# Altium schematic sheet Ikea Environmental Sensors.SchDoc
size Tabloid; SheetNumber: 2; SheetTotal: 2; ENG_APP_DATE: --/--/--; DSN_APP_DATE: --/--/--; CHK_APP_DATE: --/--/--
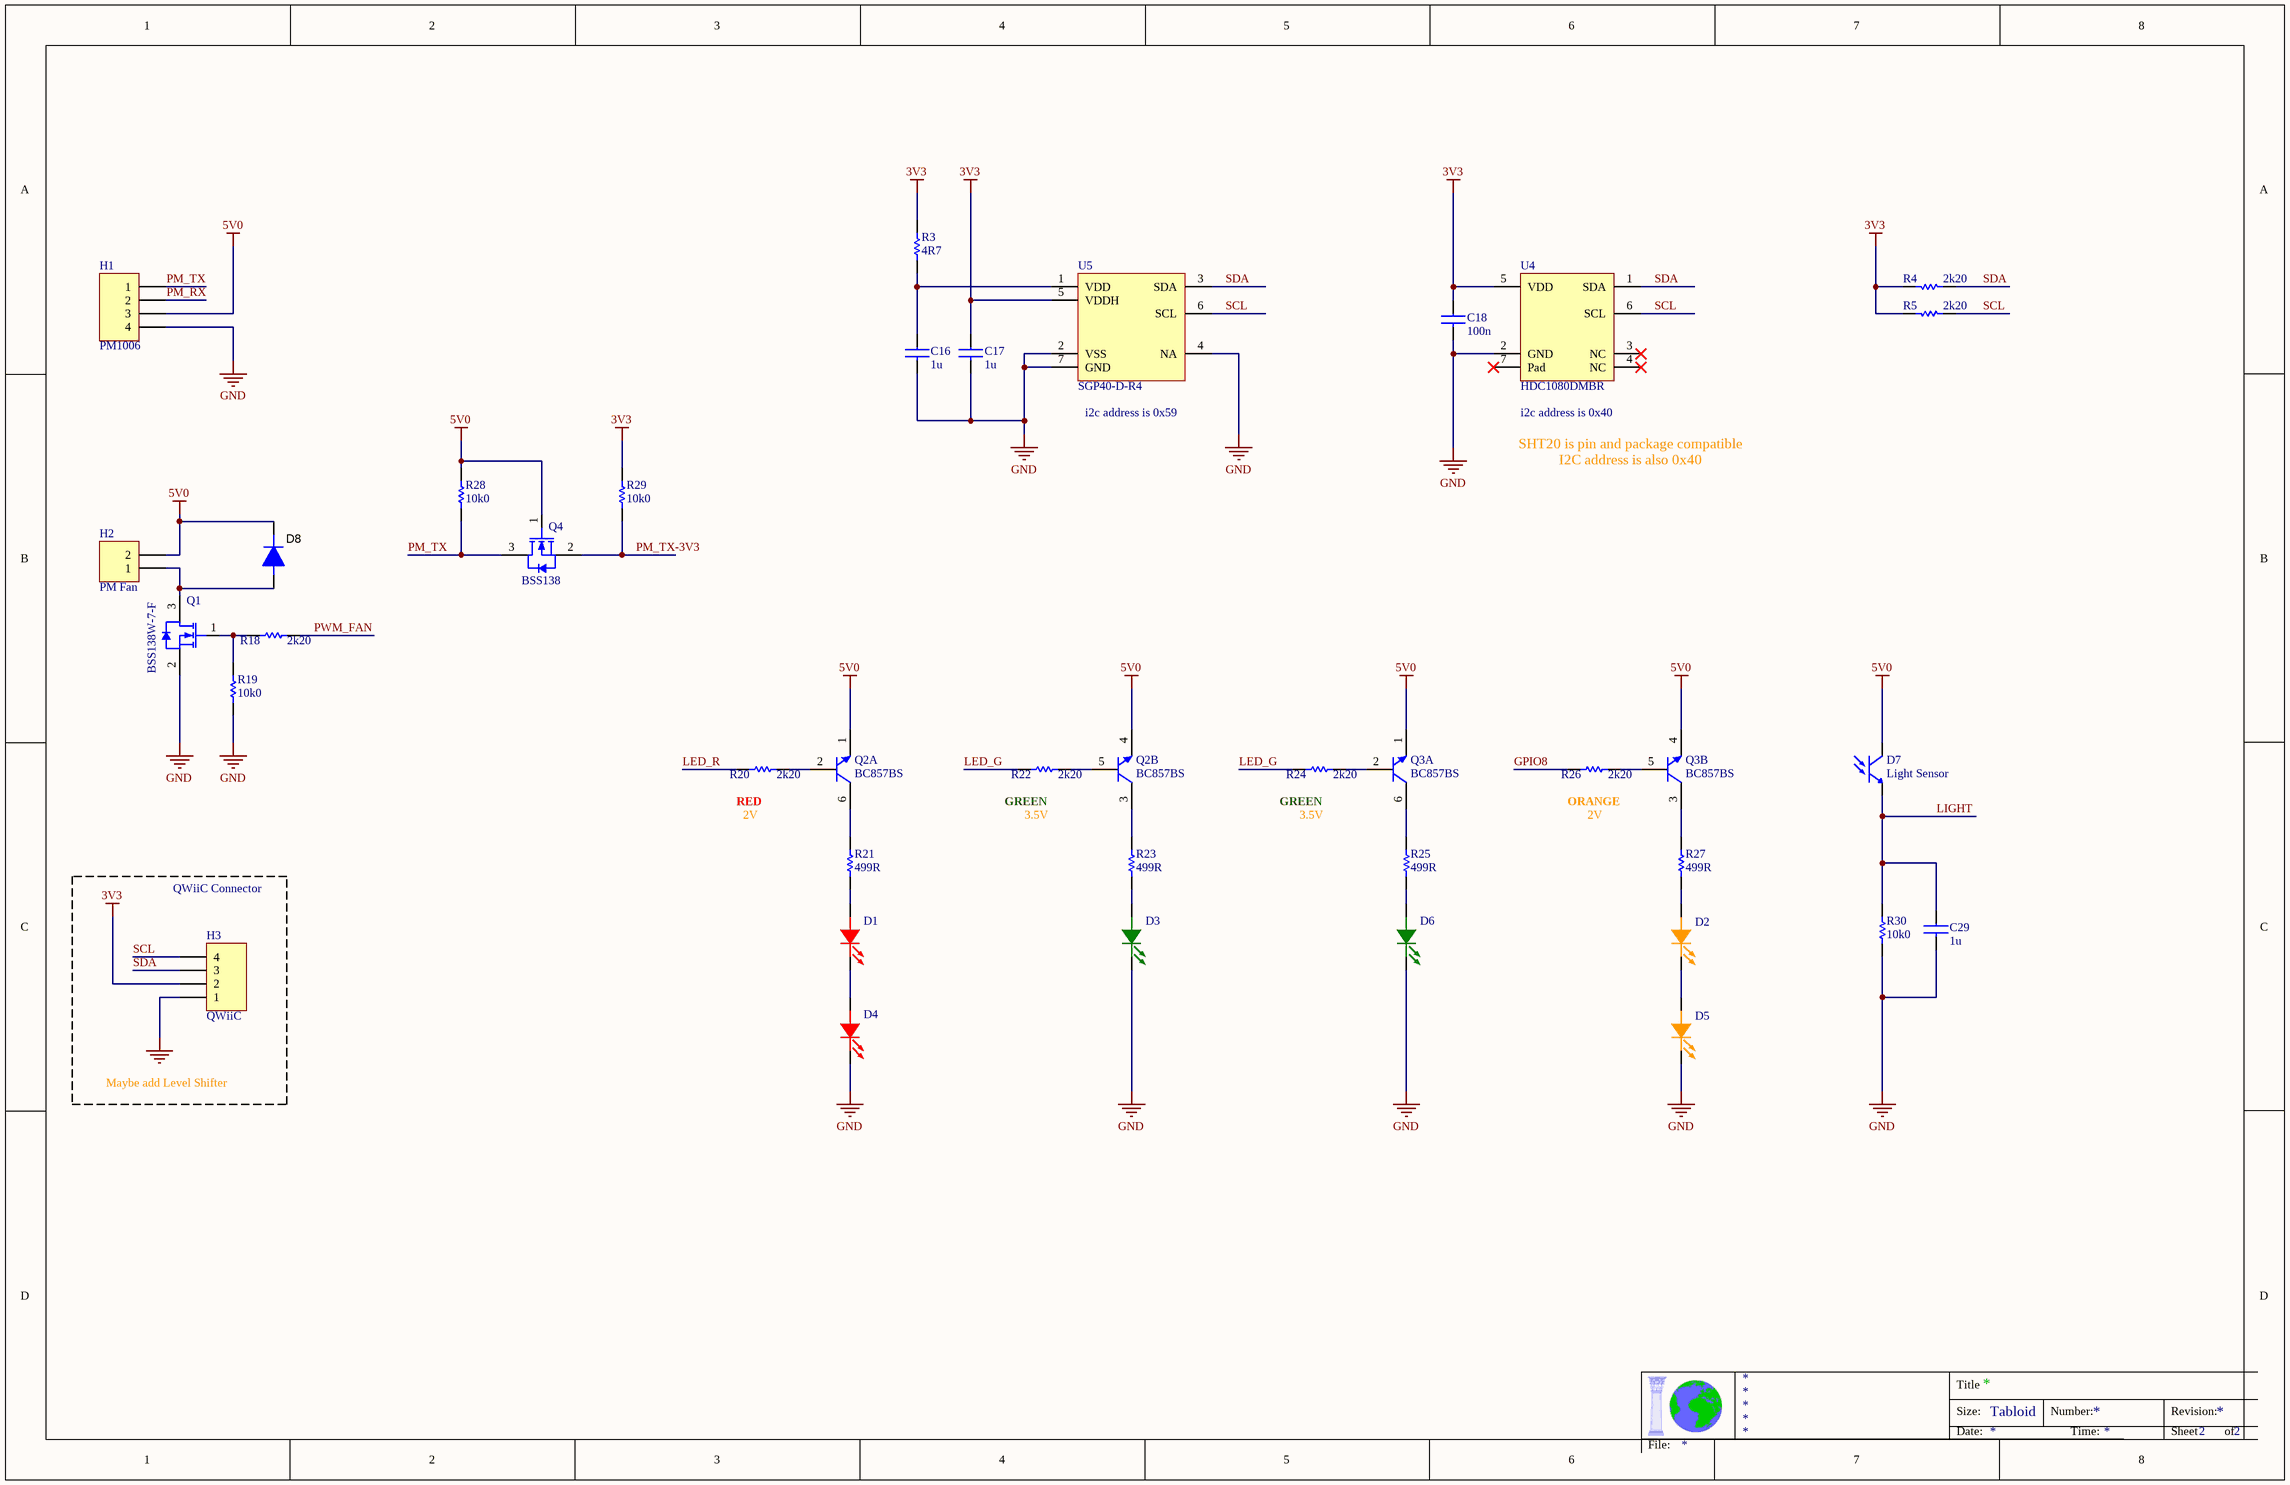
[diagram p0: Ikea Environmental Sensors.SchDoc]

## Parts
C16  1u  [C_0402_N]
C17  1u  [C_0402_N]
C18  100n  [C_0402_N]
C29  1u  [C_0402_N]
D1  0603 Red  [D_0603]  (value not drawn)
D2  0603 Orange  [D_0603]  (value not drawn)
D3  0603 Green  [D_0603]  (value not drawn)
D4  0603 Red  [D_0603]  (value not drawn)
D5  0603 Orange  [D_0603]  (value not drawn)
D6  0603 Green  [D_0603]  (value not drawn)
D7  Light Sensor  [XDCR_ALS-PT19-315C/L177/TR8]
D8  1N4148  [SOD-523]  (value not drawn)
H1  PM1006  [HDR1x4_1.5mm_RA_TH]
H2  PM Fan  [HDR1x2_1.25mm_RA_TH]
H3  QWiiC  [JST SM04B-SRSS-TB]
Q1  BSS138W-7-F  [SOT323]
Q2  BC857BS  [SOT363_N]  (parts A,B of 2)
Q3  BC857BS  [SOT363_N]  (parts A,B of 2)
Q4  BSS138  [SOT323]
R3  4R7  [R_0402-N]
R4  2k20  [R_0402-N]
R5  2k20  [R_0402-N]
R18  2k20  [R_0402-N]
R19  10k0  [R_0402-N]
R20  2k20  [R_0402-N]
R21  499R  [R_0402-N]
R22  2k20  [R_0402-N]
R23  499R  [R_0402-N]
R24  2k20  [R_0402-N]
R25  499R  [R_0402-N]
R26  2k20  [R_0402-N]
R27  499R  [R_0402-N]
R28  10k0  [R_0402-N]
R29  10k0  [R_0402-N]
R30  10k0  [R_0402-N]
U4  HDC1080DMBR  [DMB0006A]
U5  SGP40-D-R4  [SGP40_SEN-M]

## Nets
3V3: C17.1 C18.1 H3.2 R3.2 R4.1 R5.1 R29.2 U4.5(VDD) U5.5(VDDH)
5V0: D7.1(ANODE) D8.2(K) H1.3 H2.2 Q2.1(E) Q2.4(E) Q3.1(E) Q3.4(E) Q4.1(G) R28.2
GND: C16.2 C17.2 C18.2 C29.2 D3.2(CATHODE) D4.2(CATHODE) D5.2(CATHODE) D6.2(CATHODE) H1.4 H3.1 Q1.2(S) R19.1 R30.1 U4.2(GND) U5.2(VSS) U5.4(NA) U5.7(GND)
GPIO8: R26.2
LED_G: R22.2 R24.2
LED_R: R20.2
LIGHT: C29.1 D7.2(CATHODE) R30.2
PM_RX: H1.2
PM_TX: H1.1 Q4.3(D) R28.1
PM_TX-3V3: Q4.2(S) R29.1
PWM_FAN: R18.1
SCL: H3.4 R5.2 U4.6(SCL) U5.6(SCL)
SDA: H3.3 R4.2 U4.1(SDA) U5.3(SDA)
NetC16_1: C16.1 R3.1 U5.1(VDD)
NetD1_1: D1.1(ANODE) R21.1
NetD1_2: D1.2(CATHODE) D4.1(ANODE)
NetD2_1: D2.1(ANODE) R27.1
NetD2_2: D2.2(CATHODE) D5.1(ANODE)
NetD3_1: D3.1(ANODE) R23.1
NetD6_1: D6.1(ANODE) R25.1
NetD8_1: D8.1(A) H2.1 Q1.3(D)
NetQ1_1: Q1.1(G) R18.2 R19.2
NetQ2_2: Q2.2(B) R20.1
NetQ2_3: Q2.3(C) R23.2
NetQ2_5: Q2.5(B) R22.1
NetQ2_6: Q2.6(C) R21.2
NetQ3_2: Q3.2(B) R24.1
NetQ3_3: Q3.3(C) R27.2
NetQ3_5: Q3.5(B) R26.1
NetQ3_6: Q3.6(C) R25.2

Not connected (* = marked no-connect by the designer): U4 3(NC)* 4(NC)* 7(Pad)*

## Notes on the sheet
- (near U5) i2c address is 0x59
- (near U4) i2c address is 0x40
- SHT20 is pin and package compatible
  I2C address is also 0x40
- (near R20) RED
- (near R20) 2V
- (near R22) GREEN
- (near R22) 3.5V
- (near R24) GREEN
- (near R24) 3.5V
- (near R26) ORANGE
- (near R26) 2V
- QWiiC Connector
- Maybe add Level Shifter
- Title
- Size:
- Date:
- Tabloid
- Number:
- Time:
- Revision:
- Sheet
- of
- File:

## Library data of the parts
C16 C17 C29 = C_1u_10V_10_0402_NIC: Cap, Chip, 1uF, 10V, 10%, X5R, 0402; Manufacturer: NIC; Manufacturer_No: NMC0402X5R105K10TRPF; IOT: IOT-; Dist_No: NMC0402X5R105K10TRPF; Distributor: Avnet; HelpURL: http://www.niccomp.com/catalog/nmc2.pdf; Price: 0.0056; Supplier 1: Future Electronics; Supplier Part Number 1: NMC0402X5R105K10TRPF-CUTT
C18 = C_100n_16V_10_0402_NIC: Cap, Chip, 100nF, 16V, +/-10%, X7R, 0402; Manufacturer: NIC; Manufacturer_No: NMC0402X7R104K16TRPF; HelpURL: http://www.niccomp.com/catalog/nmc3.pdf; IOT: IOT-0301; Supplier 1: Future Electronics; Supplier Part Number 1: NMC0402X7R104K16TRPF-REEL
D1 D4 = D_LED-0603_LTST-C190KRKT: 0603 LED, Red, Vf=1.6-2.4V; Manufacturer: Lite-on; Distributor: Arrow; Dist_No: LTST-C190KRKT; Manufacturer_No: LTST-C190KRKT; HelpURL: http://optoelectronics.liteon.com/upload/download/DS-22-99-0151/LTST-C190KRKT.pdf; Price: 0.0376; IOT: IOT-0708; Supplier 1: Arrow Electronics; Supplier Part Number 1: LTST-C190KRKT; JLCPCB Part #: C84256; ComponentLink1Description: Datasheet; ComponentLink1URL: http://optoelectronics.liteon.com/upload/download/DS-22-99-0151/LTST-C190KRKT.pdf
D2 D5 = D_LED-0603_LTST-C190KFKT: 0603 LED, Orange, Vf=2.0-2.4V; Manufacturer: Lite-on; IOT: IOT-; Supplier 1: Arrow Electronics; Supplier Part Number 1: LTST-C190KFKT; Manufacturer_No: LTST-C190KFKT; Distributor: Arrow; HelpURL: https://optoelectronics.liteon.com/upload/download/DS-22-99-0186/LTST-C190KFKT.PDF; Price: 0.0376; Dist_No: LTST-C190KFKT; ComponentLink1Description: Datasheet; ComponentLink1URL: https://optoelectronics.liteon.com/upload/download/DS-22-99-0186/LTST-C190KFKT.PDF; JLCPCB Part #: C146215
D3 D6 = D_LED-0603_LTST-C190KGKT: 0603 LED, Green, Vf=1.9-2.4V; Manufacturer: Lite-on; Distributor: Arrow; Dist_No: LTST-C190KGKT; Manufacturer_No: LTST-C190KGKT; HelpURL: http://optoelectronics.liteon.com/upload/download/DS22-2000-074/S_110_LTST-C190KGKT.pdf; Price: 0.0376; IOT: IOT-0171; Supplier 1: Digi-Key; Supplier Part Number 1: 160-1435-1-ND; JLCPCB Part #: C72043; ComponentLink1Description: Datasheet; ComponentLink1URL: http://optoelectronics.liteon.com/upload/download/DS22-2000-074/S_110_LTST-C190KGKT.pdf
D7 = Q_Photodiode_ALS-PT19_2-SMD: Sensor, Photo, 630NM, 2-SMD; Manufacturer: Lite-on; Dist_No: ALS-PT19-315C/L177/TR8; IOT: IOT-; Distributor: Avnet; Manufacturer_No: ALS-PT19-315C/L177/TR8; HelpURL: https://everlighteurope.com/index.php?controller=attachment&id_attachment=5170; Price: 0.0376; Supplier 1: Digi-Key; Supplier Part Number 1: 1080-1244-1-ND; ComponentLink1Description: Datasheet; ComponentLink1URL: https://everlighteurope.com/index.php?controller=attachment&id_attachment=5170; JLCPCB Part #: C146233
D8 = D_1N4148WT_SOD523: Diode, Signal, 300-mA, 75-V, 350-mW, SOD523; Manufacturer: NextGeb; IOT: IOT-; Value: 1N4148WT; Manufacturer_No: 1N4148WT; Dist_No: 1N4148WT; Distributor: Arrow; HelpURL: https://media.digikey.com/pdf/Data%20Sheets/NextGen%20Components%20PDFs/SOD523148WTST4.pdf; Price: 0.0119; ComponentLink1Description: Datasheet; ComponentLink1URL: https://media.digikey.com/pdf/Data%20Sheets/NextGen%20Components%20PDFs/SOD523148WTST4.pdf; Supplier 1: Arrow Electronics; Supplier Part Number 1: 1N4148WT-7; JLCPCB Part #: C511874
H1 = Header 4_RA_1.5mm_TH: Header, 4-Pin; Manufacturer: JST; Manufacturer_No: S4B-ZR; Supplier 1: Verical; Supplier Part Number 1: S4B-ZR-SM4A-TF; JLCPCB Part #: C225169; ComponentLink1Description: Datasheet; ComponentLink1URL: https://www.jst-mfg.com/product/pdf/eng/eZH.pdf?61639681cff8b
H2 = Header 2_1.25_TH: Header, 2-Pin; ComponentLink1Description: Datasheet-Vertical; ComponentLink1URL: https://www.molex.com/pdm_docs/sd/530470210_sd.pdf; ComponentLink2Description: Datasheet-RA; ComponentLink2URL: https://www.molex.com/pdm_docs/sd/530480210_sd.pdf
H3 = Header 4_RA_1.00mm_SMT: Header, 4-Pin; Manufacturer: JST; Manufacturer_No: SM04B-SRSS-TB(LF)(SN); IOT: IOT-; Supplier 1: Digi-Key; Supplier Part Number 1: 455-1804-1-ND; JLCPCB Part #: C145956
Q1 = Q_N-CH_50V_A200_BSS138W_SOT323: MOSFET N-Channel 50V, 200mA, 200mW, SOT323; Manufacturer: Diodes Inc.; Manufacturer_No: BSS138W -7-F; Distributor: Avnet; Dist_No: BSS138W -7-F; HelpURL: http://www.diodes.com/datasheets/ds30206.pdf; Price: 0.23; IOT: IOT-0233; Supplier 1: Digi-Key; Supplier Part Number 1: BSS138W-FDITR-ND
Q2 Q3 = Q_BC857BS,115_SOT363: PNP GP Double Transistor, 45V,100mA, SOT363; Manufacturer: NXP; Manufacturer_No: BC857BS,115; Dist_No: BC857BS,115; Distributor: Arrow; HelpURL: https://assets.nexperia.com/documents/data-sheet/BC857BS.pdf; Price: 0.12000; ComponentLink1Description: Datasheet; ComponentLink1URL: https://assets.nexperia.com/documents/data-sheet/BC857BS.pdf; JLCPCB Part #: C8654; Supplier 1: Future Electronics; Supplier Part Number 1: 4266805
Q4 = Q_N-CH_50V_A200_BSS138W_SOT323: MOSFET N-Channel 50V, 200mA, 200mW, SOT323; Manufacturer_No: BSS138W -7-F; Manufacturer: Diodes Inc.; Distributor: Avnet; Dist_No: BSS138W -7-F; HelpURL: http://www.diodes.com/datasheets/ds30206.pdf; Price: 0.23; IOT: IOT-0233; Supplier 1: Digi-Key; Supplier Part Number 1: BSS138W-FDITR-ND
R3 = R_4R7_60mW_1_0402_NIC: Resistor, 4.7 Ω, 1%, 0.06W, 0402; Manufacturer_No: NRC04F4R70TRF; Manufacturer: NIC; IOT: IOT-; Distributor: NIC; Dist_No: NRC04F4R70TRF; HelpURL: http://www.niccomp.com/catalog/nrc.pdf; Value: 4R7; Supplier 1: Arrow Electronics; Supplier Part Number 1: NRC04F4R70TRF
R4 R5 R18 R20 R22 R24 R26 = R_2k20_60mW_1_0402_NIC: Resistor, 2.20 kΩ, 1%, 0.06W, 0402; Manufacturer_No: NRC04F2201TRF; Manufacturer: NIC; Value: 2.2k; HelpURL: http://www.niccomp.com/catalog/nrc.pdf; IOT: IOT-0099; Supplier 1: Arrow Electronics; Supplier Part Number 1: NRC04F2201TRF
R19 R28-R30 = R_10k0_60mW_1_0402_NIC: Resistor, 10.0 kΩ, 1%, 0.06W, 0402; Manufacturer_No: NRC04F1002TRF; Manufacturer: NIC; Value: 10k; HelpURL: http://www.niccomp.com/catalog/nrc.pdf; IOT: IOT-0100
R21 R23 R25 R27 = R_499R_60mW_1_0402_NIC: Resistor, 499 Ω, 1%, 0.06W, 0402; Manufacturer_No: NRC04F4990TRF; Manufacturer: NIC; IOT: IOT-; Value: 499; Distributor: NIC; Dist_No: NRC04F4990TRF; HelpURL: http://www.niccomp.com/catalog/nrc.pdf; Supplier 1: Arrow Electronics; Supplier Part Number 1: NRC04F4990TRF
U4 = U_HDC1080DMBR_DFN6: IC, Digital Temp & Humidity Sensor, DFN6; Manufacturer: Texas Instruments; Distributor: Arrow; Dist_No: HDC1080DMBR; HelpURL: https://www.ti.com/lit/ds/symlink/hdc1080.pdf; Manufacturer_No: HDC1080DMBR; Price: 2.20; IOT: *; JLCPCB Part #: C82227; ComponentLink1Description: Datasheet; ComponentLink1URL: https://www.ti.com/lit/ds/symlink/hdc1080.pdf; Supplier 1: LCSC; Supplier Part Number 1: C82227
U5 = U_SGP40-D-R4_DFN6: IC, Air Quality Gas Sensor, DFN6; Manufacturer: Sensirion; Manufacturer_No: SGP40-D-R4; ComponentLink1Description: Datasheet; ComponentLink1URL: https://media.digikey.com/pdf/Data%20Sheets/Sensirion%20PDFs/Sensirion_Gas_Sensors_Datasheet_SGP40.pdf#page=16; Supplier 1: Verical; Supplier Part Number 1: SGP40-D-R4